# Altium schematic sheet 05.SchDoc
size 496 x 347 mm
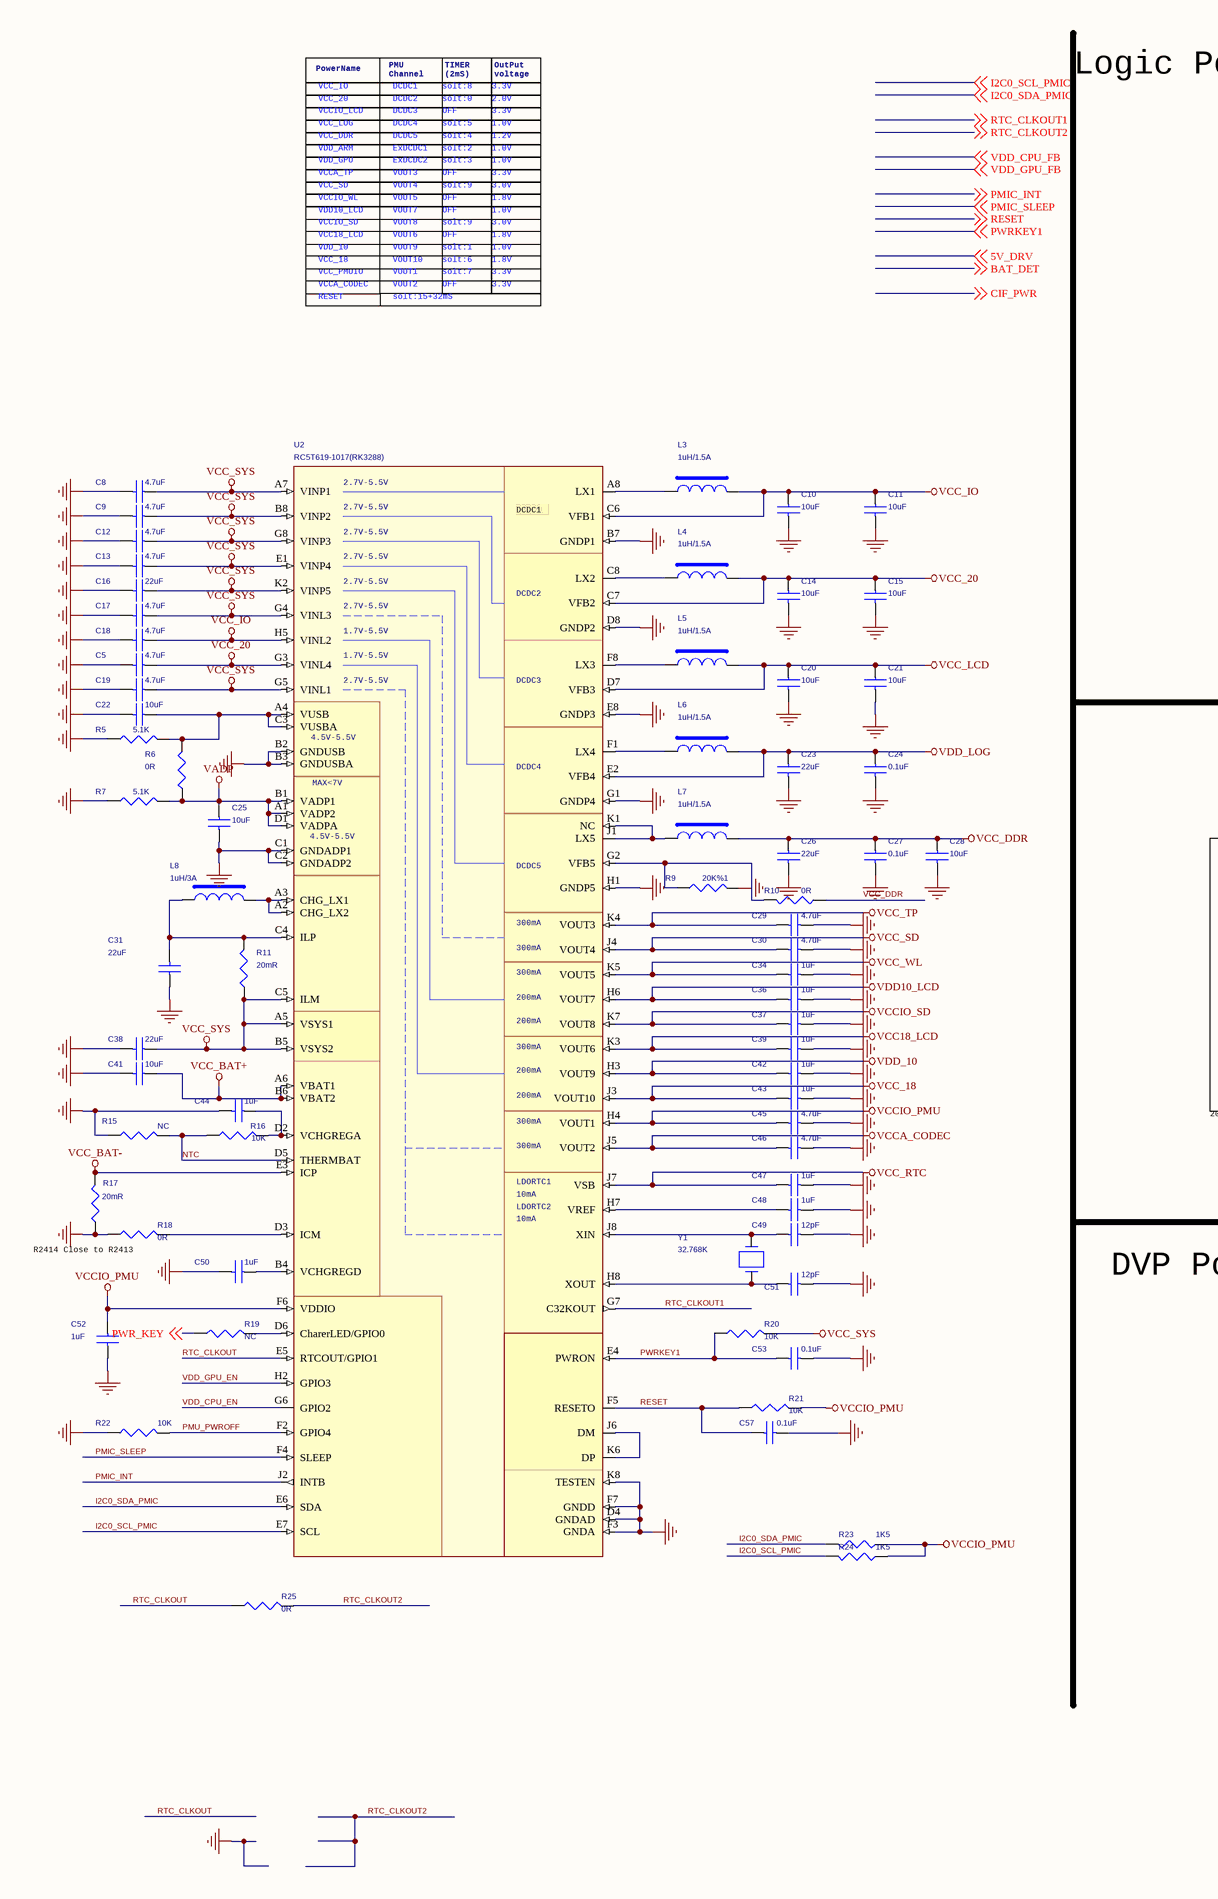
[diagram p0: 05.SchDoc, left]
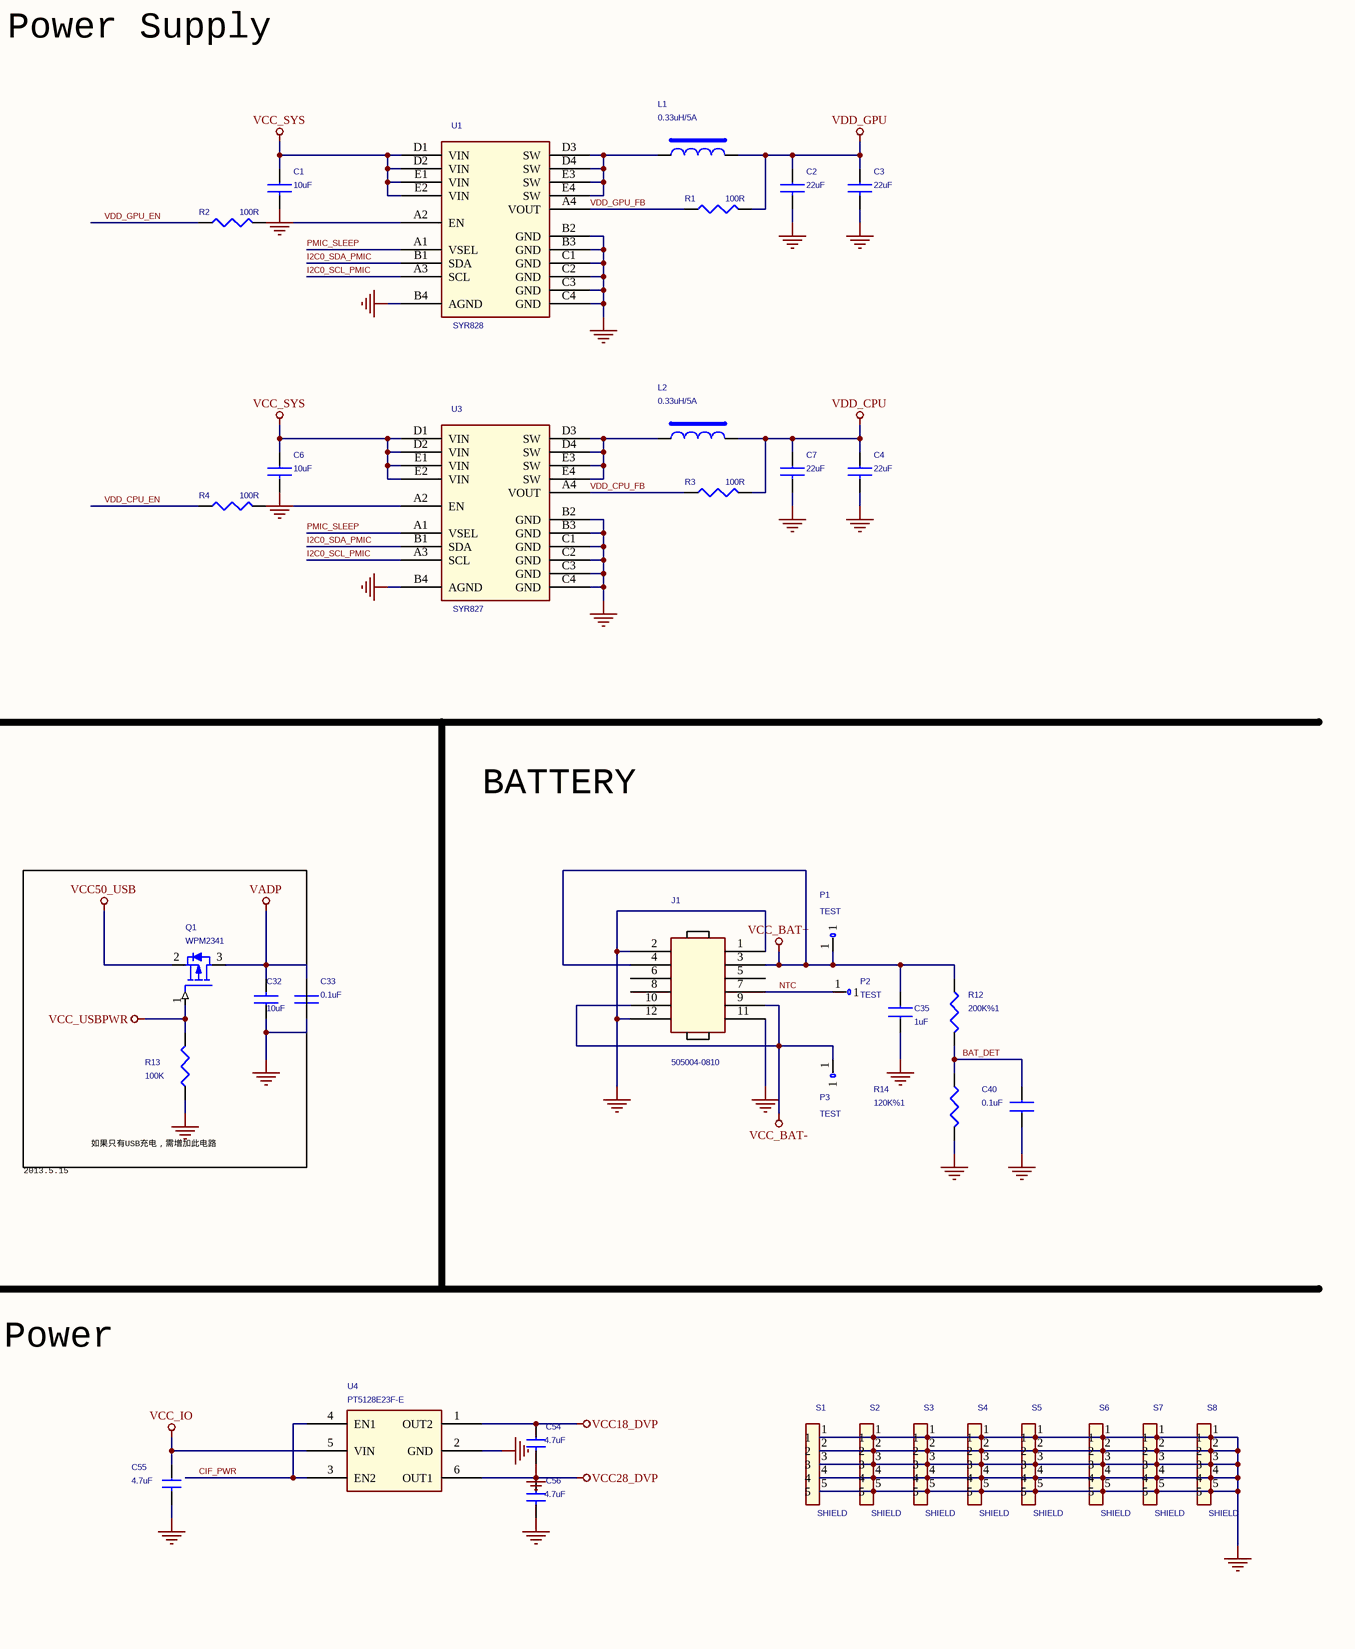
[diagram p1: 05.SchDoc, right]

## Parts
C1  10uF  [C0603]
C2  22uF  [C0805]
C3  22uF  [C0805]
C4  22uF  [C0805]
C5  4.7uF  [C0603]
C6  10uF  [C0603]
C7  22uF  [C0805]
C8  4.7uF  [C0603]
C9  4.7uF  [C0603]
C10  10uF  [C0603]
C11  10uF  [C0603]
C12  4.7uF  [C0603]
C13  4.7uF  [C0603]
C14  10uF  [C0603]
C15  10uF  [C0603]
C16  22uF  [C0805]
C17  4.7uF  [C0603]
C18  4.7uF  [C0603]
C19  4.7uF  [C0603]
C20  10uF  [C0603]
C21  10uF  [C0603]
C22  10uF  [C0603]
C23  22uF  [C0805]
C24  0.1uF  [c0402]
C25  10uF  [C0603]
C26  22uF  [C0805]
C27  0.1uF  [c0402]
C28  10uF  [C0603]
C29  4.7uF  [C0603]
C30  4.7uF  [C0603]
C31  22uF  [C0805]
C32  10uF  [C0603]
C33  0.1uF  [C0402]
C34  1uF  [c0402]
C35  1uF  [C0603]
C36  1uF  [c0402]
C37  1uF  [c0402]
C38  22uF  [C0805]
C39  1uF  [c0402]
C40  0.1uF  [C0603]
C41  10uF  [C0603]
C42  1uF  [c0402]
C43  1uF  [c0402]
C44  1uF  [c0402]
C45  4.7uF  [C0603]
C46  4.7uF  [C0603]
C47  1uF  [c0402]
C48  1uF  [c0402]
C49  12pF  [c0402]
C50  1uF  [c0402]
C51  12pF  [c0402]
C52  1uF  [c0402]
C53  0.1uF  [c0402]
C54  4.7uF  [C0603]
C55  4.7uF  [C0603]
C56  4.7uF  [C0603]
C57  0.1uF  [c0402]
J1  505004-0810  [505004-0810]
L1  0.33uH/5A  [IND-4X4]
L2  0.33uH/5A  [IND-4X4]
L3  1uH/1.5A  [IND-3X3]
L4  1uH/1.5A  [IND-3X3]
L5  1uH/1.5A  [IND-3X3]
L6  1uH/1.5A  [IND-3X3]
L7  1uH/1.5A  [IND-3X3]
L8  1uH/3A  [IND-5X5]
P1  TEST  [TEST]
P2  TEST  [TEST]
P3  TEST  [TEST]
Q1  WPM2341  [SOT23]
R1  100R  [r0402]
R2  100R  [r0402]
R3  100R  [r0402]
R4  100R  [r0402]
R5  5.1K  [r0402]
R6  0R  [R0402]
R7  5.1K  [r0402]
R9  20K%1  [r0402]
R10  0R  [r0402]
R11  20mR  [R1210]
R12  200K%1  [r0402]
R13  100K  [r0402]
R14  120K%1  [r0402]
R15  NC  [r0402]
R16  10K  [r0402]
R17  20mR  [R1210]
R18  0R  [r0402]
R19  NC  [r0402]
R20  10K  [r0402]
R21  10K  [r0402]
R22  10K  [r0402]
R23  1K5  [r0402]
R24  1K5  [r0402]
R25  0R  [r0402]
S1  SHIELD  [0_9MM_SHIELD]
S2  SHIELD  [0_9MM_SHIELD]
S3  SHIELD  [0_9MM_SHIELD]
S4  SHIELD  [0_9MM_SHIELD]
S5  SHIELD  [0_9MM_SHIELD]
S6  SHIELD  [0_9MM_SHIELD]
S7  SHIELD  [0_9MM_SHIELD]
S8  SHIELD  [0_9MM_SHIELD]
U1  SYR828  [WLCSP-20]
U2  RC5T619-1017(RK3288)  [CSP0608-80]
U3  SYR827  [WLCSP-20]
U4  PT5128E23F-E  [SOT26]
Y1  32.768K  [CRY-MC146]

## Blocks framed on the sheet
如果只有USB充电，需增加此电路: C32 Q1 R13

## Nets
GND: C1.2 C2.2 C3.2 C4.2 C5.2 C6.2 C7.2 C8.2 C9.2 C10.2 C11.2 C12.2 C13.2 C14.2 C15.2 C16.2 C17.2 C18.2 C19.2 C20.2 C21.2 C22.2 C23.2 C24.2 C25.2 C26.2 C27.2 C28.2 C29.2 C30.2 C31.1 C32.1 C33.1 C34.2 C35.1 C36.2 C37.2 C38.2 C39.2 C40.1 C41.2 C42.2 C43.2 C44.2 C45.2 C46.2 C47.2 C48.2 C49.2 C50.2 C51.2 C52.2 C53.2 C54.2 C55.2 C56.2 C57.2 J1.1 J1.2 J1.11 J1.12 R5.1 R7.1 R9.2 R13.1 R14.1 R15.2 R17.1 R18.2 R22.1 S1.1 S1.2 S1.3 S1.4 S1.5 S2.1 S2.2 S2.3 S2.4 S2.5 S3.1 S3.2 S3.3 S3.4 S3.5 S4.1 S4.2 S4.3 S4.4 S4.5 S5.1 S5.2 S5.3 S5.4 S5.5 S6.1 S6.2 S6.3 S6.4 S6.5 S7.1 S7.2 S7.3 S7.4 S7.5 S8.1 S8.2 S8.3 S8.4 S8.5 U1.B2(GND) U1.B3(GND) U1.B4(AGND) U1.C1(GND) U1.C2(GND) U1.C3(GND) U1.C4(GND) U2.B2(GNDUSB) U2.B3(GNDUSBA) U2.B7(GNDP1) U2.C1(GNDADP1) U2.C2(GNDADP2) U2.D4(GNDAD) U2.D8(GNDP2) U2.E8(GNDP3) U2.F3(GNDA) U2.F7(GNDD) U2.G1(GNDP4) U2.H1(GNDP5) U2.K8(TESTEN) U3.B2(GND) U3.B3(GND) U3.B4(AGND) U3.C1(GND) U3.C2(GND) U3.C3(GND) U3.C4(GND) U4.2(GND)
VADP: C25.1 C32.2 C33.2 Q1.3(DRAIN) R6.1 R7.2 U2.A1(VADP2) U2.B1(VADP1) U2.D1(VADPA)
VCC18_DVP: C54.1 U4.1(OUT2)
VCC18_LCD: C39.1 U2.K3(VOUT6)
VCC28_DVP: C56.1 U4.6(OUT1)
VCC50_USB: Q1.2(SOURCE)
VCC_18: C43.1 U2.J3(VOUT10)
VCC_20: C5.1 C14.1 C15.1 L4.2 U2.C7(VFB2) U2.G3(VINL4)
VCC_BAT+: C35.2 C41.1 J1.3 J1.4 P1.1 R12.2 U2.A6(VBAT1) U2.B6(VBAT2)
VCC_BAT-: J1.9 J1.10 P3.1 R17.2 U2.E3(ICP)
VCC_DDR: C26.1 C27.1 C28.1 L7.2 R10.1
VCC_IO: C10.1 C11.1 C18.1 C55.1 L3.2 U2.C6(VFB1) U2.H5(VINL2) U4.5(VIN)
VCC_LCD: C20.1 C21.1 L5.2 U2.D7(VFB3)
VCC_RTC: C47.1 U2.J7(VSB)
VCC_SD: C30.1 U2.J4(VOUT4)
VCC_SYS: C1.1 C6.1 C8.1 C9.1 C12.1 C13.1 C16.1 C17.1 C19.1 C38.1 R11.1 R20.2 U1.D1(VIN) U1.D2(VIN) U1.E1(VIN) U1.E2(VIN) U2.A5(VSYS1) U2.A7(VINP1) U2.B5(VSYS2) U2.B8(VINP2) U2.C5(ILM) U2.E1(VINP4) U2.G4(VINL3) U2.G5(VINL1) U2.G8(VINP3) U2.K2(VINP5) U3.D1(VIN) U3.D2(VIN) U3.E1(VIN) U3.E2(VIN)
VCC_TP: C29.1 U2.K4(VOUT3)
VCC_USBPWR: Q1.1(GATE) R13.2
VCC_WL: C34.1 U2.K5(VOUT5)
VCCA_CODEC: C46.1 U2.J5(VOUT2)
VCCIO_PMU: C45.1 C52.1 R21.1 R23.2 R24.2 U2.F6(VDDIO) U2.H4(VOUT1)
VCCIO_SD: C37.1 U2.K7(VOUT8)
VDD10_LCD: C36.1 U2.H6(VOUT7)
VDD_10: C42.1 U2.H3(VOUT9)
VDD_CPU: C4.1 C7.1 L2.2 R3.1
VDD_GPU: C2.1 C3.1 L1.2 R1.1
VDD_LOG: C23.1 C24.1 L6.2 U2.E2(VFB4)
BAT_DET: C40.2 R12.1 R14.2 ; off-sheet BAT_DET
CIF_PWR: U4.3(EN2) U4.4(EN1) ; off-sheet CIF_PWR
I2C0_SCL_PMIC: R24.1 U1.A3(SCL) U2.E7(SCL) U3.A3(SCL) ; off-sheet I2C0_SCL_PMIC
I2C0_SDA_PMIC: R23.1 U1.B1(SDA) U2.E6(SDA) U3.B1(SDA) ; off-sheet I2C0_SDA_PMIC
NTC: J1.7 P2.1 R15.1 R16.2 U2.D5(THERMBAT)
PMIC_INT: U2.J2(INTB) ; off-sheet PMIC_INT
PMIC_SLEEP: U1.A1(VSEL) U2.F4(SLEEP) U3.A1(VSEL) ; off-sheet PMIC_SLEEP
PMU_PWROFF: R22.2 U2.F2(GPIO4)
PWR_KEY: R19.1 ; off-sheet PWR_KEY
PWRKEY1: C53.1 R20.1 U2.E4(PWRON) ; off-sheet PWRKEY1
RESET: C57.1 R21.2 U2.F5(RESETO) ; off-sheet RESET
RTC_CLKOUT: R25.2 U2.E5(RTCOUT/GPIO1)
RTC_CLKOUT1: U2.G7(C32KOUT) ; off-sheet RTC_CLKOUT1
RTC_CLKOUT2: R25.1 ; off-sheet RTC_CLKOUT2
VDD_CPU_EN: R4.2 U2.G6(GPIO2)
VDD_CPU_FB: R3.2 U3.A4(VOUT) ; off-sheet VDD_CPU_FB
VDD_GPU_EN: R2.2 U2.H2(GPIO3)
VDD_GPU_FB: R1.2 U1.A4(VOUT) ; off-sheet VDD_GPU_FB
NetC22_1: C22.1 R5.2 R6.2 U2.A4(VUSB) U2.C3(VUSBA)
NetC31_2: C31.2 L8.1 R11.2 U2.C4(ILP)
NetC44_1: C44.1 R16.1 U2.D2(VCHGREGA)
NetC48_1: C48.1 U2.H7(VREF)
NetC49_1: C49.1 U2.J8(XIN) Y1.1
NetC50_1: C50.1 U2.B4(VCHGREGD)
NetC51_1: C51.1 U2.H8(XOUT) Y1.2
NetL1_1: L1.1 U1.D3(SW) U1.D4(SW) U1.E3(SW) U1.E4(SW)
NetL2_1: L2.1 U3.D3(SW) U3.D4(SW) U3.E3(SW) U3.E4(SW)
NetL3_1: L3.1 U2.A8(LX1)
NetL4_1: L4.1 U2.C8(LX2)
NetL5_1: L5.1 U2.F8(LX3)
NetL6_1: L6.1 U2.F1(LX4)
NetL7_1: L7.1 U2.J1(LX5) U2.K1(NC)
NetL8_2: L8.2 U2.A2(CHG_LX2) U2.A3(CHG_LX1)
NetR2_1: R2.1 U1.A2(EN)
NetR4_1: R4.1 U3.A2(EN)
NetR9_1: R9.1 R10.2 U2.G2(VFB5)
NetR18_1: R18.1 U2.D3(ICM)
NetR19_2: R19.2 U2.D6(CharerLED/GPIO0)
NetU2_J6: U2.J6(DM) U2.K6(DP)

Not connected (* = marked no-connect by the designer): J1 5 6 8

## Notes on the sheet
- PowerName
- VCCIO_LCD
- VCC_IO
- VCC_20
- PMU
  Channel
- DCDC1
- DCDC3
- DCDC2
- solt:8
- solt:0
- OFF
- TIMER
  (2mS)
- 3.3V
- 2.0V
- OutPut
  voltage
- Logic Power Supply
- VDD_ARM
- VCC_DDR
- VCC_LOG
- VDD_GPU
- VCCA_TP
- ExDCDC2
- DCDC4
- ExDCDC1
- VOUT3
- DCDC5
- solt:4
- solt:2
- solt:5
- solt:3
- 1.0V
- 1.2V
- VCC_SD
- VCCIO_WL
- VCC18_LCD
- VDD10_LCD
- VCCIO_SD
- VOUT4
- VOUT6
- VOUT8
- VOUT7
- VOUT5
- solt:9
- 3.0V
- 1.8V
- VCCA_CODEC
- VCC_18
- VDD_10
- VCC_PMUIO
- RESET
- VOUT2
- VOUT10
- VOUT9
- VOUT1
- solt:15+32mS
- solt:6
- solt:1
- solt:7
- BATTERY
- 2013.5.15
- R2414 Close to R2413
- DVP Power
- (in symbol 5T619_2) 2.7V-5.5V; DCDC1 /; DCDC2; 1.7V-5.5V; DCDC3; 4.5V-5.5V; DCDC4; MAX<7V; DCDC5; 300mA; 200mA; LDORTC1; 10mA; LDORTC2

## Library data of the parts
C1-C4 C6 C7 C49 C51 = CAP NP_4: ROOM: 5
C5 C8-C31 C34 C36-C39 C41-C48 C50 C52 C53 C57 = CAP NP_2: ROOM: 5
C32 = CAP NP_1: RoHS CHIP CAP 10uF +10/-10% X5R; ROOM: 5; MARK: 106
C33 = CAP NP_Dup2: RoHS CHIP CAP 0.1uF +10/-10% X7R; ROOM: 5
C35 = CAP NP_Dup3: RoHS CHIP CAP 1uF +10/-10% 16V X5R; ROOM: 5
C40 = CAP NP_Dup3: RoHS CHIP CAP 0.1uF +10/-10% X7R; ROOM: 5
C54-C56 = SMALL CAP: 贴片电容; ROOM: 5
J1 = HEADER 6X2: ROOM: 5
L1-L8 = INDUCTORS OF FERRITE_Dup1: ROOM: 5
P1-P3 = TEST_0: ROOM: 5
Q1 = MOSFET P: MOSFET-P,WPM2341 ,-20V,+/-8V,-2.8A,56m Ohm@Vgs=-2.5V,44m Ohm@Vgs=-4.5V,SOT23; ROOM: 5
R1-R4 R23 R24 = RESISTOR_1_Dup2: RES,thick film,47KOhm,+/-5%,1/16W,SMD0402; ROOM: 5
R5 R7 R9 R17 R18 R21 R22 R25 = RESISTOR_1: 贴片电阻; MARK: 51K; ROOM: 5
R6 R10 R11 R15 R16 R19 R20 = RESISTOR_1: 贴片电阻; ROOM: 5; MARK: 51K
R12 R14 = RES 1B_Dup1: ROHS CHIP RES 100K 1/16W 1%; ROOM: 5
R13 = RESISTOR: ROHS CHIP RES 10K 1/16W +/-5%; ROOM: 5; MARK: 51K
S1-S8 = SHIELD: ROOM: 5
U1 U3 = BB27_1: ROOM: 5
U2 = 5T619_2: ROOM: 5
U4 = PT5127: ROOM: 5; Name: INS52770960
Y1 = CRYSTAL: Crystal,32.768KHz,+/-30ppm,12pF,MC146,-10°C ~ +60   °C; ROOM: 5; Part Type: 晶体类\无源晶体